# Altium schematic sheet ISL6236A_PS.SchDoc
size A3
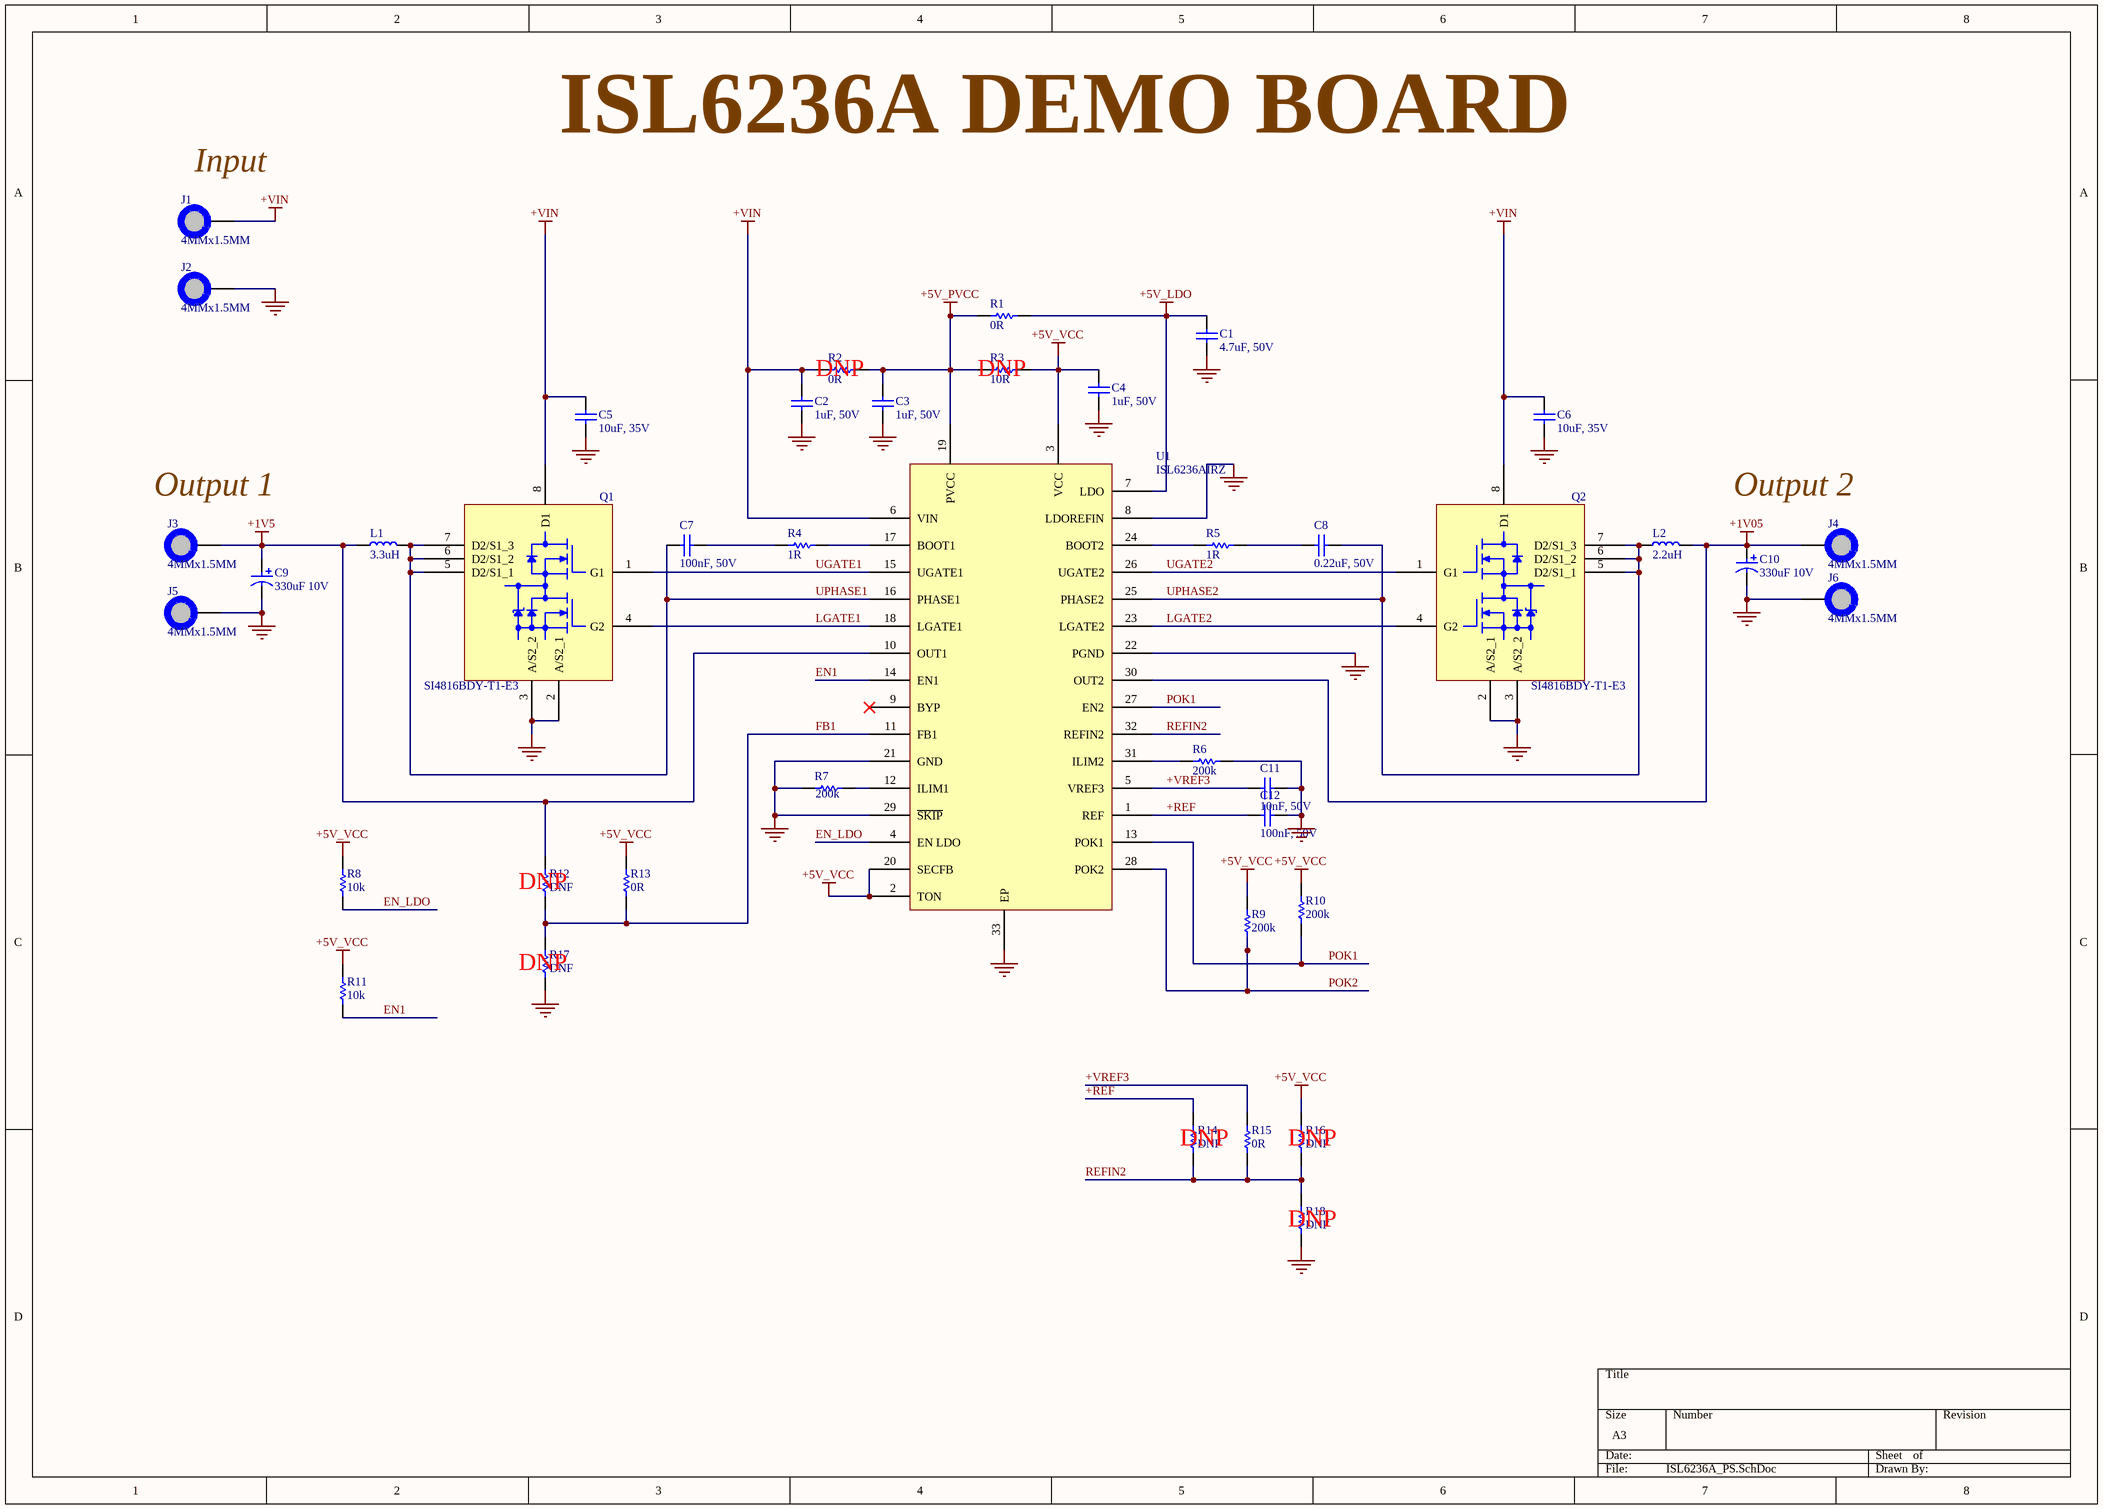
[diagram p0: ISL6236A_PS.SchDoc]

## Parts
C1  4.7uF, 50V  [CAP1206]
C2  1uF, 50V  [Cap0805]
C3  1uF, 50V  [Cap0805]
C4  1uF, 50V  [Cap0805]
C5  10uF, 35V  [CAP 1210]
C6  10uF, 35V  [CAP 1210]
C7  100nF, 50V  [Cap0805]
C8  0.22uF, 50V  [Cap0805]
C9  330uF 10V  [CAP 7343-43]
C10  330uF 10V  [CAP 7343-43]
C11  10nF, 50V  [Cap0805]
C12  100nF, 50V  [Cap0805]
J1  4MMx1.5MM  [PAD_WITH_HOLE_4MMx1MM5]
J2  4MMx1.5MM  [PAD_WITH_HOLE_4MMx1MM5]
J3  4MMx1.5MM  [PAD_WITH_HOLE_4MMx1MM5]
J4  4MMx1.5MM  [PAD_WITH_HOLE_4MMx1MM5]
J5  4MMx1.5MM  [PAD_WITH_HOLE_4MMx1MM5]
J6  4MMx1.5MM  [PAD_WITH_HOLE_4MMx1MM5]
L1  3.3uH  [IND_DR125]
L2  2.2uH  [IND_DR125]
Q1  SI4816BDY-T1-E3  [SOP8]
Q2  SI4816BDY-T1-E3  [SOP8]
R1  0R  [RES0805]
R2  0R  [RES0805]
R3  10R  [RES0805]
R4  1R  [RES0805]
R5  1R  [RES0805]
R6  200k  [RES0805]
R7  200k  [RES0805]
R8  10k  [RES0805]
R9  200k  [RES0805]
R10  200k  [RES0805]
R11  10k  [RES0805]
R12  DNF  [RES0805]
R13  0R  [RES0805]
R14  DNF  [RES0805]
R15  0R  [RES0805]
R16  DNF  [RES0805]
R17  DNF  [RES0805]
R18  DNF  [RES0805]
U1  ISL6236AIRZ  [L32.5x5B]

## Nets
+1V5: C9.1 J3.1 L1.1 R12.2 U1.10(OUT1)
+1V05: C10.1 J4.1 L2.2 U1.30(OUT2)
+5V_LDO: C1.2 R1.2 U1.7(LDO)
+5V_PVCC: C3.2 R1.1 R2.2 R3.1 U1.19(PVCC)
+5V_VCC: C4.2 R3.2 R8.2 R9.2 R10.2 R11.2 R13.2 R16.2 U1.2(TON) U1.3(VCC) U1.20(SECFB)
+VIN: C2.2 C5.2 C6.2 J1.1 Q1.8(D1) Q2.8(D1) R2.1 U1.6(VIN)
GND: C1.1 C2.1 C3.1 C4.1 C5.1 C6.1 C9.2 C10.2 C11.2 C12.2 J2.1 J5.1 J6.1 Q1.2(A/S2_1) Q1.3(A/S2_2) Q2.2(A/S2_1) Q2.3(A/S2_2) R6.2 R7.1 R17.1 R18.1 U1.8(LDOREFIN) U1.21(GND) U1.22(PGND) U1.29(~{SKIP}) U1.33(EP)
+REF: C12.1 R14.2 U1.1(REF)
+VREF3: C11.1 R15.2 U1.5(VREF3)
EN1: R11.1 U1.14(EN1)
EN_LDO: R8.1 U1.4(EN_LDO)
FB1: R12.1 R13.1 R17.2 U1.11(FB1)
LGATE1: Q1.4(G2) U1.18(LGATE1)
LGATE2: Q2.4(G2) U1.23(LGATE2)
POK1: R10.1 U1.13(POK1) U1.27(EN2)
POK2: R9.1 U1.28(POK2)
REFIN2: R14.1 R15.1 R16.1 R18.2 U1.32(REFIN2)
UGATE1: Q1.1(G1) U1.15(UGATE1)
UGATE2: Q2.1(G1) U1.26(UGATE2)
UPHASE1: C7.1 L1.2 Q1.5(D2/S1_1) Q1.6(D2/S1_2) Q1.7(D2/S1_3) U1.16(PHASE1)
UPHASE2: C8.2 L2.1 Q2.5(D2/S1_1) Q2.6(D2/S1_2) Q2.7(D2/S1_3) U1.25(PHASE2)
NetC7_2: C7.2 R4.1
NetC8_1: C8.1 R5.2
NetR4_2: R4.2 U1.17(BOOT1)
NetR5_1: R5.1 U1.24(BOOT2)
NetR6_1: R6.1 U1.31(ILIM2)
NetR7_2: R7.2 U1.12(ILIM1)

Not connected (* = marked no-connect by the designer): U1 9(BYP)*

## Notes on the sheet
- (near J1) Input
- ISL6236A DEMO BOARD
- (near R2) DNP
- (near R3) DNP
- (near J3) Output 1
- Output 2
- (near R12) DNP
- (near R17) DNP
- (near R14) DNP
- (near R16) DNP
- (near R18) DNP

## Library data of the parts
C1 = C3216X5R1H475K160AB: CAP CER 4.7UF 50V X5R 1206; Manufacturer: TDK; Dielectric Material: Ceramic; Tolerance: 10%; Supplier 1: Digi-Key; Manufacturer Part Number: C3216X5R1H475K160AB; Stock 1: 1452; Pricing 1: 1 = 0.98000, 10 = 0.72500, 100 = 0.49680, 500 = 0.39330, 1000 = 0.33120 (USD); RoHS: Yes; Mount: Surface Mount; Case/Package: 1206; Weight: 0.000571oz; Case Code (Imperial): 1206; Case Code (Metric): 3216; Min Operating Temperature: -55°C; Max Operating Temperature: 85°C; Capacitance: 4.7uF; Dielectric: X5R; Packaging: Tape and Reel; Voltage Rating: 50V; Voltage Rating (DC): 50V; Termination: SMD/SMT; Package Quantity: 1; Composition: Ceramic; Length: 3.2mm; Height: 1.6mm; Width: 1.6mm; Thickness: 0.071inch; Depth: 1.6mm; Lead Free: Lead Free; ComponentLink1URL: https://datasheet.ciiva.com/24216/c3216x5r1h475k160ab-265269-24216325.pdf?src-supplier=Mouser; ComponentLink1Description: https://datasheet.ciiva.com/24216/c3216x5r1h475k160ab-265269-24216325.pdf?src-supplier=Mouser; ComponentLink2URL: https://datasheet.ciiva.com/6286/tdkmlcccaprange-6286230.pdf?src-supplier=Digi-Key; ComponentLink2Description: https://datasheet.ciiva.com/6286/tdkmlcccaprange-6286230.pdf?src-supplier=Digi-Key; ComponentLink3URL: https://datasheet.ciiva.com/6286/tdkmlcccaprange-6286233.pdf?src-supplier=Digi-Key; ComponentLink3Description: https://datasheet.ciiva.com/6286/tdkmlcccaprange-6286233.pdf?src-supplier=Digi-Key; ComponentLink4URL: https://datasheet.ciiva.com/6286/tdkmlcccaprange-6286236.pdf?src-supplier=Digi-Key; ComponentLink4Description: https://datasheet.ciiva.com/6286/tdkmlcccaprange-6286236.pdf?src-supplier=Digi-Key; Supplier Part Number 1: 445-5994-1-ND
C2-C4 = C0805C105K5RACTU: CAP CER SMD/SMT 1uF 50 Volts 10% X7R; Manufacturer: KEMET; Dielectric Material: Ceramic; Supplier 1: Arrow; Manufacturer Part Number: C0805C105K5RACTU; Stock 1: 152500; Pricing 1: 2500 = 0.19810, 1 = 0.63060, 10 = 0.35630, 25 = 0.35270, 100 = 0.21020, 250 = 0.19810 (USD); RoHS: Yes; Mount: Surface Mount; Case/Package: 0805; Case Code (Metric): 2012; Case Code (Imperial): 0805; Contact Plating: Tin; Min Operating Temperature: -55°C; Max Operating Temperature: 125°C; Packaging: Tape and Reel; Capacitance: 1uF; Tolerance: 10%; Voltage Rating (DC): 50V; Dielectric: X7R; Voltage Rating: 50V; Package Quantity: 1; Termination: SMD/SMT; Voltage: 50V; Length: 2mm; Height: 1.25mm; Depth: 1.25mm; Width: 0.049inch; Thickness: 0.055inch; REACH SVHC: No SVHC; ComponentLink1URL: https://datasheet.ciiva.com/7842/1732744-7842192.pdf?src-supplier=Element14; ComponentLink1Description: https://datasheet.ciiva.com/7842/1732744-7842192.pdf?src-supplier=Element14; ComponentLink2URL: https://datasheet.ciiva.com/22700/1851736-22700523.pdf?src-supplier=Element14; ComponentLink2Description: https://datasheet.ciiva.com/22700/1851736-22700523.pdf?src-supplier=Element14; ComponentLink3URL: https://datasheet.ciiva.com/5408/kem-c1002-x7r-smd-5408569.pdf?src-supplier=Mouser; ComponentLink3Description: https://datasheet.ciiva.com/5408/kem-c1002-x7r-smd-5408569.pdf?src-supplier=Mouser; Supplier Part Number 1: C0805C105K5RACTU
C5 C6 = C1210C106K6PACTU: CAP CER 10UF 35V X5R 1210; Manufacturer: KEMET; Dielectric Material: Ceramic; Dissipation Factor: 2.5%; Tolerance: 10%; Supplier 1: Digi-Key; Manufacturer Part Number: C1210C106K6PACTU; Stock 1: 22122; Pricing 1: 1 = 0.89000, 10 = 0.65800, 100 = 0.45140, 500 = 0.35740, 1000 = 0.30096 (USD); RoHS: Yes; Mount: Surface Mount; Case/Package: 1210; Case Code (Metric): 3225; Case Code (Imperial): 1210; Min Operating Temperature: -55°C; Max Operating Temperature: 85°C; Packaging: Tape and Reel; Capacitance: 10uF; Voltage Rating: 35V; Voltage: 35V; Dielectric: X5R; Termination: Solder; Voltage Rating (DC): 35V; Length: 0.126inch; Height: 1.9mm; Width: 0.098inch; Thickness: 0.083inch; Depth: 2.5mm; Lead Free: Lead Free; ComponentLink1URL: http://www.alliedelec.com/m/d/f3c02ddb98afa3dd1adcb801109671e9.pdf?src-supplier=Allied+Electronics; ComponentLink1Description: http://www.alliedelec.com/m/d/f3c02ddb98afa3dd1adcb801109671e9.pdf?src-supplier=Allied+Electronics; ComponentLink2URL: https://api.kemet.com/component-edge/download/datasheet/C1210C106K6PAC7800.pdf?src-supplier=Digi-Key; ComponentLink2Description: https://api.kemet.com/component-edge/download/datasheet/C1210C106K6PAC7800.pdf?src-supplier=Digi-Key; ComponentLink3URL: http://www.kemet.com/docfinder?Partnumber=C1210C106K6PAC7800&src-supplier=Digi-Key; ComponentLink3Description: http://www.kemet.com/docfinder?Partnumber=C1210C106K6PAC7800&src-supplier=Digi-Key; Supplier Part Number 1: 399-12070-1-ND
C7 C12 = C0805C104K5RACTU: CAP CER 100nF; 50VDC; X7R; ±10%; SMD; 0805; Manufacturer: KEMET; Dielectric Material: Ceramic; Voltage: 500V; Supplier 1: Digi-Key; Manufacturer Part Number: C0805C104K5RACTU; Stock 1: 1010961; Pricing 1: 1 = 0.23000, 10 = 0.16600, 100 = 0.07800, 500 = 0.05472, 1000 = 0.04530 (USD); RoHS: Yes; Mount: Surface Mount; Case/Package: 0805; Number of Pins: 2; Case Code (Imperial): 0805; Case Code (Metric): 2012; Contact Plating: Tin; Min Operating Temperature: -55°C; Max Operating Temperature: 125°C; Tolerance: 10%; Dielectric: X7R; Package Quantity: 1; Voltage Rating: 50V; Packaging: Tape and Reel; Voltage Rating (DC): 50V; Termination: SMD/SMT; Length: 2mm; Height: 0.9mm; Depth: 1.25mm; Width: 1.2mm; Lead Pitch: 0.75mm; Thickness: 0.035inch; Radiation Hardening: No; REACH SVHC: No SVHC; ComponentLink1URL: https://datasheet.ciiva.com/14589/70095383-14589048.pdf?src-supplier=Allied+Electronics; ComponentLink1Description: https://datasheet.ciiva.com/14589/70095383-14589048.pdf?src-supplier=Allied+Electronics; ComponentLink2URL: https://datasheet.ciiva.com/28682/1851736-28682232.pdf?src-supplier=Element14; ComponentLink2Description: https://datasheet.ciiva.com/28682/1851736-28682232.pdf?src-supplier=Element14; ComponentLink3URL: https://datasheet.ciiva.com/32431/slceramic-chip-condensers-e-32431755.pdf?src-supplier=Distrelec; ComponentLink3Description: https://datasheet.ciiva.com/32431/slceramic-chip-condensers-e-32431755.pdf?src-supplier=Distrelec; ComponentLink4URL: https://datasheet.ciiva.com/18410/70095383-18410815.pdf?src-supplier=Allied+Electronics; ComponentLink4Description: https://datasheet.ciiva.com/18410/70095383-18410815.pdf?src-supplier=Allied+Electronics; Supplier Part Number 1: 399-1170-1-ND; Capacitance: 100nF
C8 = C0805C224K5RACTU: CAP CER 0.22UF 50V X7R 0805; Manufacturer: KEMET; Dielectric Material: Ceramic; Capacitance: 220nF; Tolerance: 10%; Dissipation Factor: 2.5%; Supplier 1: Arrow; Manufacturer Part Number: C0805C224K5RACTU; Stock 1: 4064; Pricing 1: 1 = 0.02420 (USD); RoHS: Yes; Mount: Surface Mount; Case/Package: 0805; Case Code (Metric): 2012; Case Code (Imperial): 0805; Min Operating Temperature: -55°C; Max Operating Temperature: 125°C; Package Quantity: 1; Voltage Rating: 50V; Packaging: Tape and Reel; Voltage Rating (DC): 50V; Dielectric: X7R; Termination: SMD/SMT; Voltage: 50V; Length: 2mm; Height: 0.9mm; Width: 0.049inch; Thickness: 0.055inch; Lead Pitch: 0.75mm; Depth: 1.25mm; Radiation Hardening: No; REACH SVHC: No SVHC; ComponentLink1URL: https://datasheet.ciiva.com/7842/kem-c1002-x7r-smd-7842582.pdf?src-supplier=Element14; ComponentLink1Description: https://datasheet.ciiva.com/7842/kem-c1002-x7r-smd-7842582.pdf?src-supplier=Element14; ComponentLink2URL: https://datasheet.ciiva.com/18193/getdatasheetpartid-304413-18193686.pdf?src-supplier=Verical; ComponentLink2Description: https://datasheet.ciiva.com/18193/getdatasheetpartid-304413-18193686.pdf?src-supplier=Verical; ComponentLink3URL: https://datasheet.ciiva.com/28682/1851736-28682316.pdf?src-supplier=Element14; ComponentLink3Description: https://datasheet.ciiva.com/28682/1851736-28682316.pdf?src-supplier=Element14; Supplier Part Number 1: C0805C224K5RACTU
C9 C10 = T530X337M010ATE004: Tantalum Capacitors - Polymer SMD 330uF 10volts 20%; Manufacturer: KEMET; ESR (Equivalent Series Resistance): 4mR; Leakage Current: 330uA; Polarity: Polar; Dissipation Factor: 8%; Ripple Current: 8.2A; Life (Hours): 2000Hour; Supplier 1: Digi-Key; Manufacturer Part Number: T530X337M010ATE004; Stock 1: 6637; Pricing 1: 1 = 6.86000, 10 = 6.09500, 100 = 4.87600 (USD); RoHS: Yes; Mount: Surface Mount; Case/Package: 2917; Case Code (Imperial): 2917; Case Code (Metric): 7343; Min Operating Temperature: -55°C; Max Operating Temperature: 125°C; Capacitance: 330uF; Tolerance: 20%; Package Quantity: 500; Voltage Rating (DC): 10V; Packaging: Tape and Reel; Voltage Rating: 10V; Termination: SMD/SMT; Features: General Purpose; Voltage: 10V; Length: 7.3mm; Height: 4mm; Depth: 4.3mm; Width: 4.3mm; Height - Seated (Max): 0.169inch; REACH SVHC: No SVHC; ComponentLink1URL: https://datasheet.ciiva.com/11794/0900766b80deaa91-11794477.pdf?src-supplier=RSComponents; ComponentLink1Description: https://datasheet.ciiva.com/11794/0900766b80deaa91-11794477.pdf?src-supplier=RSComponents; ComponentLink2URL: https://datasheet.ciiva.com/14593/70096008-14593753.pdf?src-supplier=Allied+Electronics; ComponentLink2Description: https://datasheet.ciiva.com/14593/70096008-14593753.pdf?src-supplier=Allied+Electronics; Supplier Part Number 1: 399-10378-1-ND
C11 = C0805F103K5RACTU: CAP CER 10000PF 50V X7R 0805; Manufacturer: KEMET; Dielectric Material: Ceramic; Tolerance: 10%; Supplier 1: Digi-Key; Manufacturer Part Number: C0805F103K5RACTU; Stock 1: 34837; Pricing 1: 1 = 0.37000, 10 = 0.25900, 100 = 0.15510, 500 = 0.11636, 1000 = 0.09826 (USD); RoHS: Yes; Mount: Surface Mount; Case/Package: 0805; Number of Pins: 2; Case Code (Imperial): 0805; Case Code (Metric): 2012; Min Operating Temperature: -55°C; Max Operating Temperature: 125°C; Capacitance: 10nF; Package Quantity: 4000; Voltage Rating: 50V; Voltage Rating (DC): 50V; Packaging: Cut Tape; Dielectric: X7R; Termination: SMD/SMT; Voltage: 50V; Length: 2mm; Height: 0.9mm; Width: 1.25mm; Lead Pitch: 0.75mm; Thickness: 0.039inch; Depth: 1.25mm; REACH SVHC: No SVHC; ComponentLink1URL: https://datasheet.ciiva.com/146/docfinderpartnumber-c0805f103k5ractu-146278.pdf?src-supplier=Digi-Key; ComponentLink1Description: https://datasheet.ciiva.com/146/docfinderpartnumber-c0805f103k5ractu-146278.pdf?src-supplier=Digi-Key; ComponentLink2URL: https://datasheet.ciiva.com/7842/48829-7842407.pdf?src-supplier=Element14; ComponentLink2Description: https://datasheet.ciiva.com/7842/48829-7842407.pdf?src-supplier=Element14; ComponentLink3URL: https://datasheet.ciiva.com/7842/48829-7842408.pdf?src-supplier=Element14; ComponentLink3Description: https://datasheet.ciiva.com/7842/48829-7842408.pdf?src-supplier=Element14; Supplier Part Number 1: 399-5107-1-ND
J1-J6 = PAD_WITH_HOLE_4MMx1MM5: PAd with a hole 4mm x 1.5mm
L1 = DR125-3R3-R: FIXED IND 3.3UH 12.7A 6.3 MOHM; Manufacturer: Eaton Coiltronics; Core Material: Ferrite; Tolerance: 20%; Shielding: Shielded; DC Resistance (DCR): 6.3mR; Test Frequency: 100kHz; RMS Current (Irms): 9.26A; Supplier 1: Digi-Key; Manufacturer Part Number: DR125-3R3-R; Stock 1: 2460; Pricing 1: 1 = 2.03000, 10 = 1.87300, 100 = 1.31130 (USD); RoHS: Yes; Mount: Surface Mount; Case/Package: 0125; Number of Pins: 2; Weight: 0.144oz; Min Operating Temperature: -40°C; Max Operating Temperature: 125°C; Packaging: Tape and Reel; Inductance Tolerance: 20%; Package Quantity: 600; Inductance: 3.3uH; Max DC Current: 12.7A; Termination: SMD/SMT; Military Standard: Not; Saturation Current: 12.7A; Self Resonant Frequency: 100kHz; Length: 12.5mm; Height: 6mm; Width: 12.5mm; Depth: 12.5mm; Radiation Hardening: No; REACH SVHC: No SVHC; Lead Free: Lead Free; ComponentLink1URL: https://datasheet.ciiva.com/46609/87246-46609257.pdf?src-supplier=Element14; ComponentLink1Description: https://datasheet.ciiva.com/46609/87246-46609257.pdf?src-supplier=Element14; Supplier Part Number 1: 513-1529-1-ND
L2 = DR125-2R2-R: FIXED IND 2.2UH 10.9A 4.5 MOHM; Manufacturer: Eaton Cooper; Core Material: Ferrite; Tolerance: 20%; Saturation Current: 15A; Shielding: Shielded; DC Resistance (DCR): 4.5mR; Test Frequency: 100kHz; Supplier 1: Digi-Key; Manufacturer Part Number: DR125-2R2-R; Stock 1: 841; Pricing 1: 1 = 2.03000, 10 = 1.87300, 100 = 1.31130 (USD); RoHS: Yes; Mount: Surface Mount; Case/Package: Nonstandard; Number of Pins: 2; Weight: 0.144oz; Min Operating Temperature: -40°C; Max Operating Temperature: 125°C; Inductance: 2.2uH; Max DC Current: 10.9A; Package Quantity: 600; Current Rating: 10.9A; Packaging: Tape and Reel; Inductance Tolerance: 20%; Composition: Wirewound; Termination: SMD/SMT; Self Resonant Frequency: 100kHz; DC Current: 10.9A; Military Standard: Not; RMS Current (Irms): 10.9A; Length: 12.5mm; Height: 6mm; Width: 0.492inch; Height - Seated (Max): 0.236inch; Depth: 12.5mm; Radiation Hardening: No; REACH SVHC: No SVHC; Lead Free: Lead Free; ComponentLink1URL: https://datasheet.ciiva.com/14667/0900766b8116a153-14667792.pdf?src-supplier=RSComponents; ComponentLink1Description: https://datasheet.ciiva.com/14667/0900766b8116a153-14667792.pdf?src-supplier=RSComponents; ComponentLink2URL: https://datasheet.ciiva.com/26926/getdatasheetpartid-571249-26926912.pdf?src-supplier=Verical; ComponentLink2Description: https://datasheet.ciiva.com/26926/getdatasheetpartid-571249-26926912.pdf?src-supplier=Verical; ComponentLink3URL: https://datasheet.ciiva.com/8004/87246-8004874.pdf?src-supplier=Element14; ComponentLink3Description: https://datasheet.ciiva.com/8004/87246-8004874.pdf?src-supplier=Element14; Supplier Part Number 1: 513-1662-1-ND
Q1 Q2 = SI4816BDY-T1-E3: MOSFET 2N-CH 30V 5.8A 8-SOIC; Manufacturer: Vishay Siliconix; Nominal Vgs: 3V; Rise Time: 9ns; Rds On Max: 18.5mR; Number of Elements: 2; Continuous Drain Current (ID): 8.2A; Drain to Source Resistance: 11.5mR; Gate to Source Voltage (Vgs): 20V; Max Power Dissipation: 1.25W; Turn-Off Delay Time: 31ns; Turn-On Delay Time: 13ns; Threshold Voltage: 1V; Element Configuration: Single; FET Type: 2 N-Channel; Supplier 1: Digi-Key; Manufacturer Part Number: SI4816BDY-T1-E3; Stock 1: 6163; Pricing 1: 1 = 1.86000, 10 = 1.68100, 100 = 1.35110, 500 = 1.05086, 1000 = 0.87071 (USD); RoHS: Yes; Mount: Surface Mount; Case/Package: SO; Number of Pins: 8; Weight: 0.006596oz; Min Operating Temperature: -55°C; Max Operating Temperature: 150°C; Packaging: Tape and Reel; Package Quantity: 1; Drain to Source Voltage (Vdss): 30V; Fall Time: 9ns; Number of Channels: 2; On-State Resistance: 18.5mR; Length: 5mm; Height: 1.55mm; Width: 4mm; Radiation Hardening: No; REACH SVHC: Unknown; Lead Free: Lead Free; ComponentLink1URL: https://datasheet.ciiva.com/7710/si4816bd-7710449.pdf?src-supplier=Element14; ComponentLink1Description: https://datasheet.ciiva.com/7710/si4816bd-7710449.pdf?src-supplier=Element14; ComponentLink2URL: https://datasheet.ciiva.com/15137/getdatasheetpartid-99188-15137841.pdf?src-supplier=Verical; ComponentLink2Description: https://datasheet.ciiva.com/15137/getdatasheetpartid-99188-15137841.pdf?src-supplier=Verical; ComponentLink3URL: https://datasheet.ciiva.com/26789/si4816bdy-t1-e3-26789112.pdf?src-supplier=IIIC; ComponentLink3Description: https://datasheet.ciiva.com/26789/si4816bdy-t1-e3-26789112.pdf?src-supplier=IIIC; ComponentLink4URL: https://datasheet.ciiva.com/18448/70026226-18448822.pdf?src-supplier=Allied+Electronics; ComponentLink4Description: https://datasheet.ciiva.com/18448/70026226-18448822.pdf?src-supplier=Allied+Electronics; ComponentLink5URL: https://datasheet.ciiva.com/11161/si4816bd-11161496.pdf?src-supplier=Avnet; ComponentLink5Description: https://datasheet.ciiva.com/11161/si4816bd-11161496.pdf?src-supplier=Avnet; ComponentLink6URL: https://datasheet.ciiva.com/928/si4816bd-928458.pdf?src-supplier=Digi-Key; ComponentLink6Description: https://datasheet.ciiva.com/928/si4816bd-928458.pdf?src-supplier=Digi-Key; ComponentLink7URL: https://datasheet.ciiva.com/928/si4816bd-928459.pdf?src-supplier=Digi-Key; ComponentLink7Description: https://datasheet.ciiva.com/928/si4816bd-928459.pdf?src-supplier=Digi-Key; ComponentLink8URL: https://datasheet.ciiva.com/928/si4816bd-928460.pdf?src-supplier=Digi-Key; ComponentLink8Description: https://datasheet.ciiva.com/928/si4816bd-928460.pdf?src-supplier=Digi-Key; ComponentLink9URL: https://datasheet.ciiva.com/16486/si4816bd-16486349.pdf?src-supplier=Future+Electronics; ComponentLink9Description: https://datasheet.ciiva.com/16486/si4816bd-16486349.pdf?src-supplier=Future+Electronics; ComponentLink10URL: https://datasheet.ciiva.com/26136/si4816bd-26136990.pdf?src-supplier=Avnet+Europe; ComponentLink10Description: https://datasheet.ciiva.com/26136/si4816bd-26136990.pdf?src-supplier=Avnet+Europe; Supplier Part Number 1: SI4816BDY-T1-E3CT-ND
R1 R2 R13 R15 = AC0805JR-070RL: Thick Film Resistors - SMD 1/8W 0.0ohm 5%; Manufacturer: Yageo; Power Rating: 125mW; Voltage Rating: 150V; Resistance: 0mR; Temperature Coefficient: 200ppm/°C; Supplier 1: Digi-Key; Manufacturer Part Number: AC0805JR-070RL; Stock 1: 217989; Pricing 1: 1 = 0.10000, 10 = 0.04700, 25 = 0.03400, 50 = 0.02580, 100 = 0.01910, 250 = 0.01456, 500 = 0.01164, 1000 = 0.00856 (USD); RoHS: Yes; Case/Package: 0805; Case Code (Imperial): 0805; Case Code (Metric): 2012; Min Operating Temperature: -55°C; Max Operating Temperature: 155°C; Packaging: Tape and Reel; Tolerance: 5%; Composition: Thick Film; Termination: SMD/SMT; Number of Terminations: 2; Max Power Dissipation: 125mW; Features: Moisture Resistant; Length: 0.079inch; Height: 0.024inch; Width: 1.25mm; Lead Free: Lead Free; ComponentLink1URL: http://www.yageo.com/documents/recent/PYu-AC_51_RoHS_L_2.pdf?src-supplier=Mouser; ComponentLink1Description: http://www.yageo.com/documents/recent/PYu-AC_51_RoHS_L_2.pdf?src-supplier=Mouser; ComponentLink2URL: http://www.yageo.com/NewPortal/yageodocoutput?fileName=/pdf/R-Chip/PYu-AC_51_RoHS_L_6.pdf&src-supplier=Digi-Key; ComponentLink2Description: http://www.yageo.com/NewPortal/yageodocoutput?fileName=/pdf/R-Chip/PYu-AC_51_RoHS_L_6.pdf&src-supplier=Digi-Key; Supplier Part Number 1: YAG3755CT-ND
R3 = AC0805FR-0710RL: Thick Film Resistors - SMD 1/8W 10ohm 1% AEC-Q200; Manufacturer: Yageo; Power Rating: 125mW; Voltage Rating: 150V; Temperature Coefficient: 200ppm/°C; Supplier 1: Digi-Key; Manufacturer Part Number: AC0805FR-0710RL; Stock 1: 547977; Pricing 1: 1 = 0.10000, 10 = 0.09000, 100 = 0.03460, 1000 = 0.01522, 2500 = 0.01315 (USD); RoHS: Yes; Case/Package: 0805; Case Code (Imperial): 0805; Case Code (Metric): 2012; Min Operating Temperature: -55°C; Max Operating Temperature: 155°C; Packaging: Tape and Reel; Resistance: 10R; Tolerance: 1%; Composition: Thick Film; Termination: SMD/SMT; Number of Terminations: 2; Military Standard: Not; Max Power Dissipation: 125mW; Features: Moisture Resistant; Length: 2mm; Height: 0.024inch; Width: 1.25mm; Depth: 1.25mm; Lead Free: Lead Free; ComponentLink1URL: http://www.mouser.com/ds/2/447/yageodocoutput-1111992.pdf?src-supplier=Mouser; ComponentLink1Description: http://www.mouser.com/ds/2/447/yageodocoutput-1111992.pdf?src-supplier=Mouser; ComponentLink2URL: http://components.arrow.com/part/dataview/0323_03350463?src-supplier=Arrow+Europe; ComponentLink2Description: http://components.arrow.com/part/dataview/0323_03350463?src-supplier=Arrow+Europe; ComponentLink3URL: http://www.yageo.com/NewPortal/yageodocoutput?fileName=/pdf/R-Chip/PYu-AC_51_RoHS_L_6.pdf&src-supplier=Digi-Key; ComponentLink3Description: http://www.yageo.com/NewPortal/yageodocoutput?fileName=/pdf/R-Chip/PYu-AC_51_RoHS_L_6.pdf&src-supplier=Digi-Key; ComponentLink4URL: http://www.yageo.com/documents/recent/PYu-AC_51_RoHS_L_2_revised.pdf?src-supplier=Future+Electronics; ComponentLink4Description: http://www.yageo.com/documents/recent/PYu-AC_51_RoHS_L_2_revised.pdf?src-supplier=Future+Electronics; Supplier Part Number 1: YAG3690CT-ND
R4 R5 = AC0805FR-071RL: AC Series 0805 0.125 W 1 Ohm ±1% ±200 ppm/°C SMT Thick Film Chip Resistor; Manufacturer: Yageo; Voltage Rating: 150V; Power Rating: 125mW; Supplier 1: Digi-Key; Manufacturer Part Number: AC0805FR-071RL; Stock 1: 24378; Pricing 1: 1 = 0.10000, 10 = 0.09000, 100 = 0.03460, 1000 = 0.01522, 2500 = 0.01315 (USD); RoHS: Yes; Case/Package: 0805; Weight: 0.000194oz; Case Code (Imperial): 0805; Case Code (Metric): 2012; Min Operating Temperature: -55°C; Max Operating Temperature: 155°C; Packaging: Tape and Reel; Tolerance: 1%; Resistance: 1R; Composition: Thick Film; Number of Terminations: 2; Termination: SMD/SMT; Max Power Dissipation: 125mW; Temperature Coefficient: 200ppm/°C; Features: Moisture Resistant; Length: 0.079inch; Height: 0.024inch; Width: 0.049inch; Lead Free: Lead Free; ComponentLink1URL: https://datasheet.ciiva.com/12576/pyu-ac-51-rohs-l-2-12576553.pdf?src-supplier=Mouser; ComponentLink1Description: https://datasheet.ciiva.com/12576/pyu-ac-51-rohs-l-2-12576553.pdf?src-supplier=Mouser; Supplier Part Number 1: YAG3705CT-ND
R6 R7 R9 R10 = AC0805FR-07200KL: Thick Film Resistors - SMD 1/8W 200K ohm 1% AEC-Q200; Manufacturer: Yageo; Power Rating: 125mW; Resistance: 200kR; Voltage Rating: 150V; Temperature Coefficient: 100ppm/°C; Supplier 1: Digi-Key; Manufacturer Part Number: AC0805FR-07200KL; Stock 1: 21982; Pricing 1: 1 = 0.10000, 10 = 0.05000, 100 = 0.02050, 1000 = 0.00921, 2500 = 0.00799 (USD); RoHS: Yes; Case/Package: 0805; Case Code (Imperial): 0805; Case Code (Metric): 2012; Min Operating Temperature: -55°C; Max Operating Temperature: 155°C; Tolerance: 1%; Packaging: Tape and Reel; Composition: Thick Film; Number of Terminations: 2; Termination: SMD/SMT; Max Power Dissipation: 125mW; Features: Moisture Resistant; Length: 0.079inch; Height: 0.024inch; Width: 0.049inch; Lead Free: Lead Free; ComponentLink1URL: http://www.mouser.com/ds/2/447/yageodocoutput-1111992.pdf?src-supplier=Mouser; ComponentLink1Description: http://www.mouser.com/ds/2/447/yageodocoutput-1111992.pdf?src-supplier=Mouser; ComponentLink2URL: http://www.yageo.com/NewPortal/yageodocoutput?fileName=/pdf/R-Chip/PYu-AC_51_RoHS_L_6.pdf&src-supplier=Digi-Key; ComponentLink2Description: http://www.yageo.com/NewPortal/yageodocoutput?fileName=/pdf/R-Chip/PYu-AC_51_RoHS_L_6.pdf&src-supplier=Digi-Key; ComponentLink3URL: http://www.yageo.com/documents/recent/PYu-AC_51_RoHS_L_2.pdf?src-supplier=Future+Electronics; ComponentLink3Description: http://www.yageo.com/documents/recent/PYu-AC_51_RoHS_L_2.pdf?src-supplier=Future+Electronics; Supplier Part Number 1: YAG3706CT-ND
R8 R11 = AC0805FR-0710KL: RES SMD 10K OHM 1% 1/8W 0805; Manufacturer: Yageo; Resistance: 10kR; Power Rating: 125mW; Voltage Rating: 150V; Temperature Coefficient: 100ppm/°C; Supplier 1: Digi-Key; Manufacturer Part Number: AC0805FR-0710KL; Stock 1: 736527; Pricing 1: 1 = 0.10000, 10 = 0.05000, 100 = 0.02050, 1000 = 0.00921, 2500 = 0.00799 (USD); RoHS: Yes; Case/Package: 0805; Case Code (Metric): 2012; Case Code (Imperial): 0805; Min Operating Temperature: -55°C; Max Operating Temperature: 155°C; Packaging: Tape and Reel; Tolerance: 1%; Package Quantity: 1; Composition: Thick Film; Number of Terminations: 2; Termination: SMD/SMT; Military Standard: Not; Max Power Dissipation: 125mW; Features: Moisture Resistant; Length: 0.079inch; Height: 0.024inch; Width: 0.049inch; Depth: 1.25mm; Lead Free: Lead Free; ComponentLink1URL: https://datasheet.ciiva.com/5558/pyu-ac-51-rohs-l-2-5558347.pdf?src-supplier=Mouser; ComponentLink1Description: https://datasheet.ciiva.com/5558/pyu-ac-51-rohs-l-2-5558347.pdf?src-supplier=Mouser; Supplier Part Number 1: 311-10KLGCT-ND
R12 R14 R16-R18 = RES General
U1 = ISL6236AIRZ: IC MAIN PWR CTRLR QUAD 32-QFN; Manufacturer: Intersil; Number of Outputs: 2; Output Current: 20A; Switching Frequency: 500kHz; Supplier 1: Digi-Key; Manufacturer Part Number: ISL6236AIRZ; Stock 1: 0; Pricing 1: 600 = 3.818000 (USD); RoHS: Yes; Mount: Surface Mount; Case/Package: QFN; Min Operating Temperature: -40°C; Max Operating Temperature: 100°C; Packaging: Rail/Tube; Package Quantity: 60; Length: 5mm; Height: 0.95mm; Width: 5mm; Radiation Hardening: No; Lead Free: Lead Free; ComponentLink1URL: https://datasheet.ciiva.com/25905/fn6453-25905351.pdf?src-supplier=Avnet+Europe; ComponentLink1Description: https://datasheet.ciiva.com/25905/fn6453-25905351.pdf?src-supplier=Avnet+Europe; Supplier Part Number 1: ISL6236AIRZ-ND